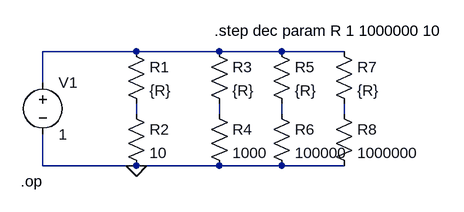
[diagram p0: schematic Divider.asc]
Divider.asc, the LTspice schematic file:
Version 4
SHEET 1 880 680
WIRE 112 32 -32 32
WIRE 240 32 112 32
WIRE 336 32 240 32
WIRE 432 32 336 32
WIRE -32 80 -32 32
WIRE 112 128 112 112
WIRE 240 128 240 112
WIRE 336 128 336 112
WIRE 432 128 432 112
WIRE -32 208 -32 160
WIRE 112 208 -32 208
WIRE 240 208 112 208
WIRE 336 208 240 208
WIRE 432 208 336 208
FLAG 112 208 0
SYMBOL res 96 16 R0
SYMATTR InstName R1
SYMATTR Value {R}
SYMBOL res 96 112 R0
SYMATTR InstName R2
SYMATTR Value 10
SYMBOL voltage -32 64 R0
WINDOW 123 0 0 Left 0
WINDOW 39 0 0 Left 0
SYMATTR InstName V1
SYMATTR Value 1
SYMBOL res 224 16 R0
SYMATTR InstName R3
SYMATTR Value {R}
SYMBOL res 224 112 R0
SYMATTR InstName R4
SYMATTR Value 1000
SYMBOL res 320 16 R0
SYMATTR InstName R5
SYMATTR Value {R}
SYMBOL res 320 112 R0
SYMATTR InstName R6
SYMATTR Value 100000
SYMBOL res 416 16 R0
SYMATTR InstName R7
SYMATTR Value {R}
SYMBOL res 416 112 R0
SYMATTR InstName R8
SYMATTR Value 1000000
TEXT 232 0 Left 2 !.step dec param R 1 1000000 10
TEXT -66 232 Left 2 !.op

The netlist it stands for:
* Divider.asc
R1 N001 N002 {R}
R2 N002 0 10
V1 N001 0 1
R3 N001 N003 {R}
R4 N003 0 1000
R5 N001 N004 {R}
R6 N004 0 100000
R7 N001 N005 {R}
R8 N005 0 1000000
.step dec param R 1 1000000 10
.op
.backanno
.end